# EAGLE design RPi-UNO-HAT_v11 (EAGLE 7.7.0)
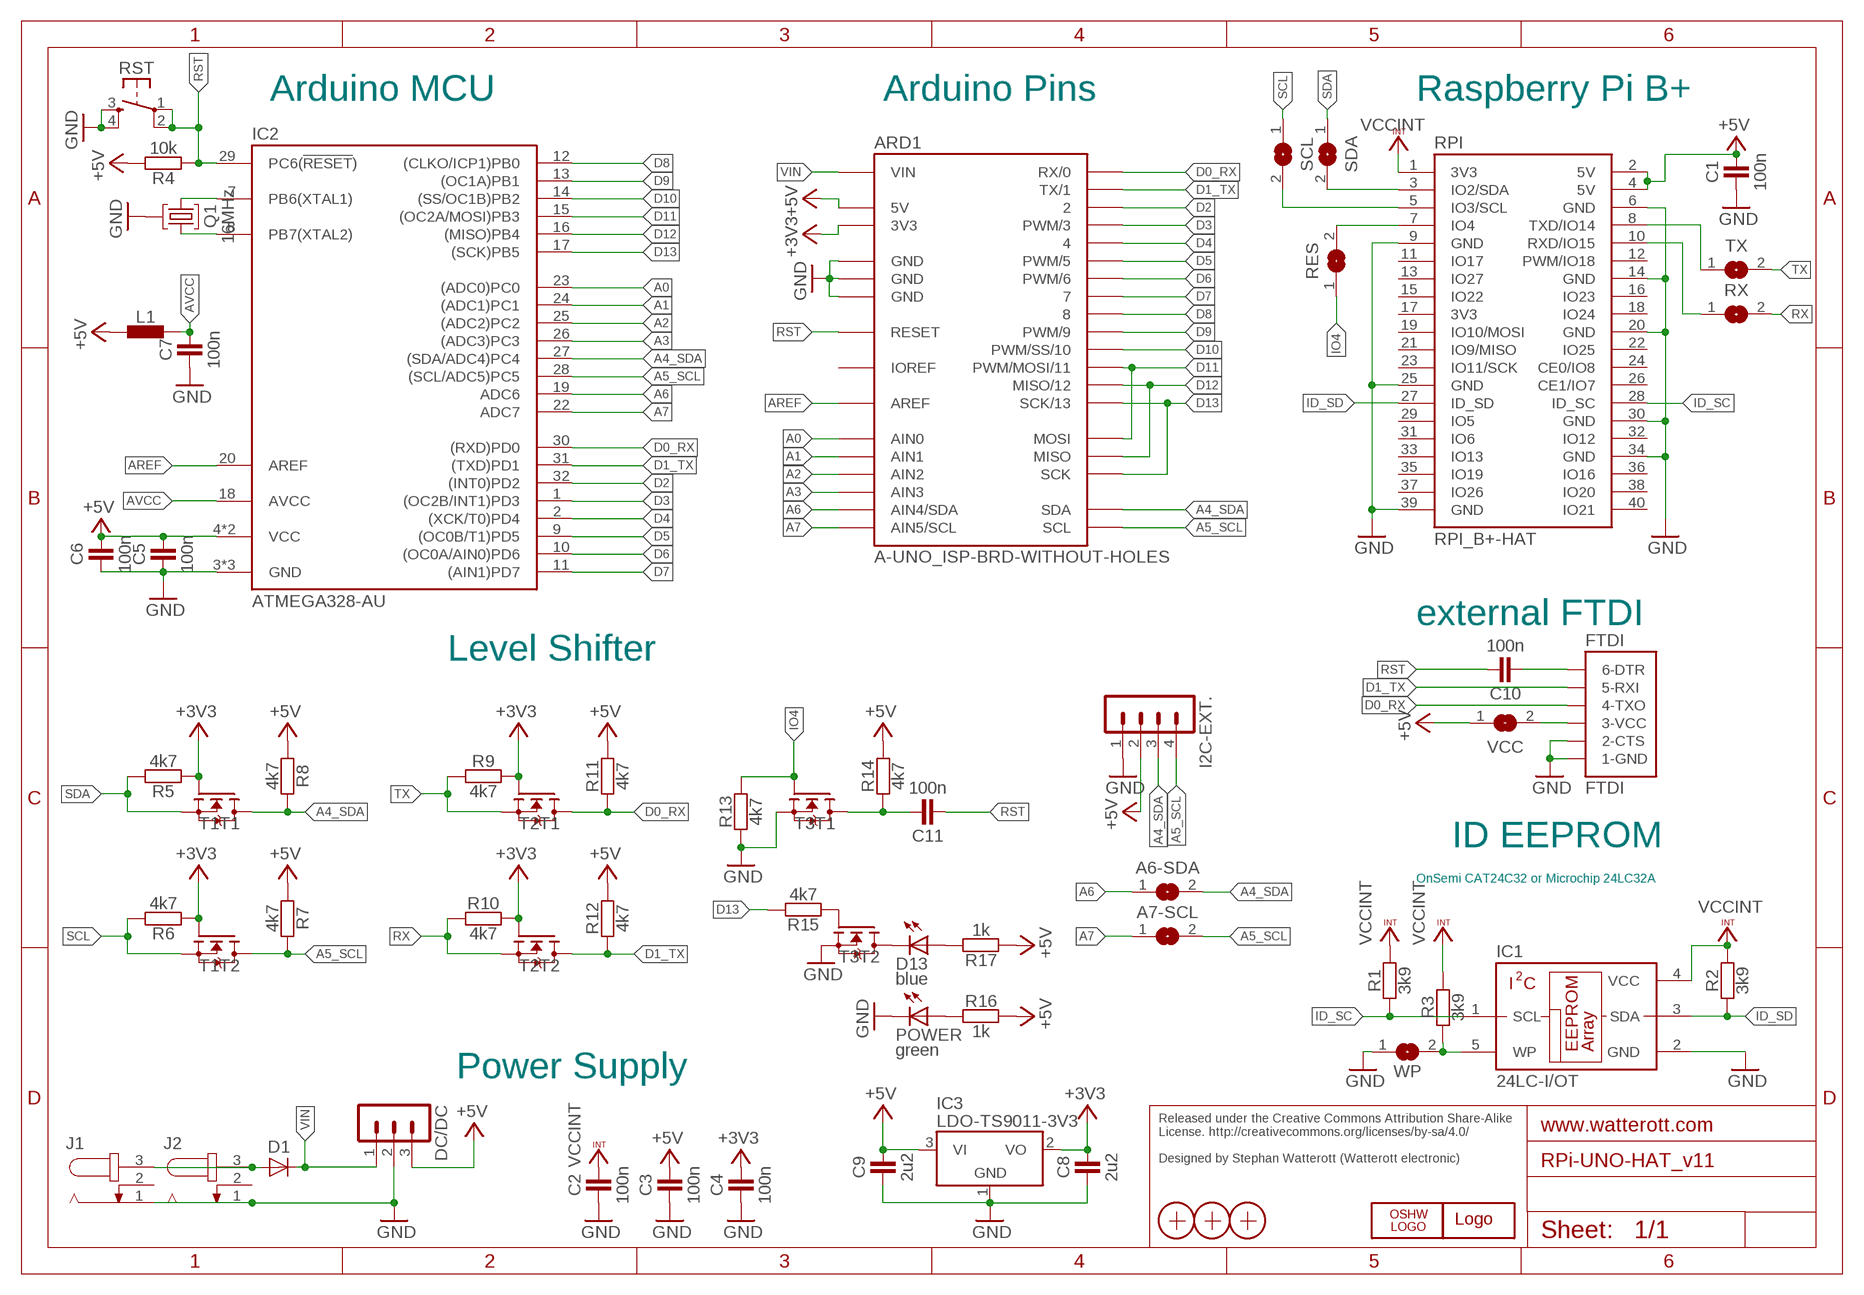
[diagram p0: schematic, sheet 1]

## Parts
A6-SDA  JUMPER2-0402-NC  [JUMPER2-0402_NC]
A7-SCL  JUMPER2-0402-NC  [JUMPER2-0402_NC]
ARD1  A-UNO_ISP-BRD-WITHOUT-HOLES  [A-UNO-ISP_CON-WITHOUT-HOLES]
C1  100n  CAPACITOR-0402  [C0402]
C2  100n  CAPACITOR-0402  [C0402]
C3  100n  CAPACITOR-0402  [C0402]
C4  100n  CAPACITOR-0402  [C0402]
C5  100n  CAPACITOR-0402  [C0402]
C6  100n  CAPACITOR-0402  [C0402]
C7  100n  CAPACITOR-0402  [C0402]
C8  2u2  CAPACITOR-0402  [C0402]
C9  2u2  CAPACITOR-0402  [C0402]
C10  100n  CAPACITOR-0402  [C0402]
C11  100n  CAPACITOR-0402  [C0402]
D1  DIODE-SOD80  [SOD80]
D13  blue  LED-0603  [C0603]
DC/DC  MA03-1  [MA03-1]
FTDI  FTDI  [FTDI]
I2C-EXT.  JST_PH_4B4B-PH-SM4-TB  [JST_B4B-PH-SM4-TB]
IC1  24LC-I/OT  [SOT23-5]
IC2  ATMEGA328-AU  [TQFP32]
IC3  LDO-TS9011-3V3  [SOT23]
J1  DC-JACK  [DC-JACK]
J2  DC-JACK  [DC-JACK]
L1  INDUCTOR-0603  [C0603]
LOGO1  LOGO-S_PLACE_S  [SPARK_TPLACE_S]
LOGO2  OSHW_LOGOX0070  [OSHW_6X70]
POWER  green  LED-0603  [C0603]
Q1  16MHz  CRYSTAL-RES-32  [CRYSTAL_32X13]
R1  3k9  RESISTOR-0402  [C0402]
R2  3k9  RESISTOR-0402  [C0402]
R3  3k9  RESISTOR-0402  [C0402]
R4  10k  RESISTOR-0402  [C0402]
R5  4k7  RESISTOR-0402  [C0402]
R6  4k7  RESISTOR-0402  [C0402]
R7  4k7  RESISTOR-0402  [C0402]
R8  4k7  RESISTOR-0402  [C0402]
R9  4k7  RESISTOR-0402  [C0402]
R10  4k7  RESISTOR-0402  [C0402]
R11  4k7  RESISTOR-0402  [C0402]
R12  4k7  RESISTOR-0402  [C0402]
R13  4k7  RESISTOR-0402  [C0402]
R14  4k7  RESISTOR-0402  [C0402]
R15  4k7  RESISTOR-0402  [C0402]
R16  1k  RESISTOR-0402  [C0402]
R17  1k  RESISTOR-0402  [C0402]
RES  JUMPER2-0402-NC  [JUMPER2-0402_NC]
RPI  RPI_B+-HAT  [RPI-B+HAT]
RST  SW-TACTILE-PTS840P  [SW_PTS840P]
RX  JUMPER2-0402-NC  [JUMPER2-0402_NC]
SCL  JUMPER2-0402-NC  [JUMPER2-0402_NC]
SDA  JUMPER2-0402-NC  [JUMPER2-0402_NC]
T1  BSS138PS  [SOT363]
T2  BSS138PS  [SOT363]
T3  BSS138PS  [SOT363]
TX  JUMPER2-0402-NC  [JUMPER2-0402_NC]
VCC  JUMPER2-0402-NC  [JUMPER2-0402_NC]
WP  JUMPER2-0603-NC  [JUMPER2-0603_NC]
X1  PASSER-07  [PASSER_07MM]
X2  PASSER-07  [PASSER_07MM]
X3  PASSER-07  [PASSER_07MM]

## Nets
+3V3: ARD1.3V3 C4.2 C8.2 IC3.2(VO) R5.1 R6.1 R9.2 R10.2 T1.2(T1:G) T1.5(T2:G) T2.2(T1:G) T2.5(T2:G)
+5V: ARD1.5V ARD1.VCC(5V) C1.2 C3.2 C5.2 C6.2 C9.2 DC/DC.3 I2C-EXT..2 IC2.4(VCC) IC2.6(VCC) IC3.3(VI) L1.1 R4.2 R7.1 R8.1 R11.2 R12.2 R14.2 R16.2 R17.1 RPI.2(5V) RPI.4(5V) VCC.1
A0: ARD1.A0(AIN0) IC2.23((ADC0)PC0)
A1: ARD1.A1(AIN1) IC2.24((ADC1)PC1)
A2: ARD1.A2(AIN2) IC2.25((ADC2)PC2)
A3: ARD1.A3(AIN3) IC2.26((ADC3)PC3)
A4_SDA: A6-SDA.2 ARD1.SDA I2C-EXT..3 IC2.27((SDA/ADC4)PC4) R8.2 T1.6(T1:D)
A5_SCL: A7-SCL.2 ARD1.SCL I2C-EXT..4 IC2.28((SCL/ADC5)PC5) R7.2 T1.3(T2:D)
A6: A6-SDA.1 ARD1.A4(AIN4/SDA) IC2.19(ADC6)
A7: A7-SCL.1 ARD1.A5(AIN5/SCL) IC2.22(ADC7)
AREF: ARD1.AREF IC2.20(AREF)
AVCC: C7.2 IC2.18(AVCC) L1.2
D0_RX: ARD1.0(RX/0) FTDI.4-TX(4-TXO) IC2.30((RXD)PD0) R11.1 T2.6(T1:D)
D0_RX1: C11.2 R14.1 T3.6(T1:D)
D1_TX: ARD1.1(TX/1) FTDI.5-RX(5-RXI) IC2.31((TXD)PD1) R12.1 T2.3(T2:D)
D2: ARD1.2 IC2.32((INT0)PD2)
D3: ARD1.3(PWM/3) IC2.1((OC2B/INT1)PD3)
D4: ARD1.4 IC2.2((XCK/T0)PD4)
D5: ARD1.5(PWM/5) IC2.9((OC0B/T1)PD5)
D6: ARD1.6(PWM/6) IC2.10((OC0A/AIN0)PD6)
D7: ARD1.7 IC2.11((AIN1)PD7)
D8: ARD1.8 IC2.12((CLKO/ICP1)PB0)
D9: ARD1.9(PWM/9) IC2.13((OC1A)PB1)
D10: ARD1.10(PWM/SS/10) IC2.14((SS/OC1B)PB2)
D11: ARD1.11(PWM/MOSI/11) ARD1.MOSI IC2.15((OC2A/MOSI)PB3)
D12: ARD1.12(MISO/12) ARD1.MISO IC2.16((MISO)PB4)
D13: ARD1.13(SCK/13) ARD1.SCK IC2.17((SCK)PB5) R15.2
GND: ARD1.GND@1(GND) ARD1.GND@2(GND) ARD1.GND@3(GND) ARD1.GND@4(GND) C1.1 C2.1 C3.1 C4.1 C5.1 C6.1 C7.1 C8.1 C9.1 DC/DC.2 FTDI.1-GND FTDI.2-CTS I2C-EXT..1 IC1.2(GND) IC2.3(GND) IC2.5(GND) IC2.21(GND) IC3.1(GND) J1.1 J2.1 POWER.C Q1.GND R13.1 RPI.6(GND) RPI.9(GND) RPI.14(GND) RPI.20(GND) RPI.25(GND) RPI.30(GND) RPI.34(GND) RPI.39(GND) RST.3(S1) RST.4(S2) T3.1(T1:S) T3.4(T2:S) WP.1
ID_SC: IC1.1(SCL) R1.1 RPI.28(ID_SC)
ID_SD: IC1.3(SDA) R2.1 RPI.27(ID_SD)
IO4: R13.2 RES.1 T3.2(T1:G)
N$1: IC2.8(PB7(XTAL2)) Q1.1
N$2: IC2.7(PB6(XTAL1)) Q1.2
N$3: D1.A J1.3 J2.3
N$4: C10.1 FTDI.6-DTR
N$6: RPI.8(TXD/IO14) TX.1
N$7: RPI.10(RXD/IO15) RX.1
N$8: RES.2 RPI.7(IO4)
N$9: FTDI.3-VCC VCC.2
N$10: RPI.5(IO3/SCL) SCL.2
N$11: RPI.3(IO2/SDA) SDA.2
N$12: R15.1 T3.5(T2:G)
N$13: POWER.A R16.1
N$14: D13.A R17.2
N$15: D13.C T3.3(T2:D)
RST: ARD1.RST2(RESET) ARD1.RST(RESET) C10.2 C11.1 IC2.29(PC6(!RESET!)) R4.1 RST.1 RST.2
RX: R10.1 RX.2 T2.4(T2:S)
SCL: R6.2 SCL.1 T1.4(T2:S)
SDA: R5.2 SDA.1 T1.1(T1:S)
TX: R9.1 T2.1(T1:S) TX.2
VCCINT: C2.2 IC1.4(VCC) R1.2 R2.2 R3.2 RPI.1(3V3)
VIN: ARD1.VIN D1.C DC/DC.1
WP: IC1.5(WP) R3.1 WP.2
Unconnected: J1.2 J2.2 RPI.11(IO17) RPI.12(PWM/IO18) RPI.13(IO27) RPI.15(IO22) RPI.16(IO23) RPI.17(3V3) RPI.18(IO24) RPI.19(IO10/MOSI) RPI.21(IO9/MISO) RPI.22(IO25) RPI.23(IO11/SCK) RPI.24(CE0/IO8) RPI.26(CE1/IO7) RPI.29(IO5) RPI.31(IO6) RPI.32(IO12) RPI.33(IO13) RPI.35(IO19) RPI.36(IO16) RPI.37(IO26) RPI.38(IO20) RPI.40(IO21)

## Notes on the sheet
- Arduino MCU | Arduino Pins | Raspberry Pi B+
- external FTDI
- Level Shifter
- ID EEPROM
- OnSemi CAT24C32 or Microchip 24LC32A
- Power Supply
- Released under the Creative Commons Attribution Share-Alike 
  License. http://creativecommons.org/licenses/by-sa/4.0/
  
  Designed by Stephan Watterott (Watterott electronic)

## Power pins joined to a net without a drawn wire
IOREF: ARD1.IOREF

## Library data of the parts
A6-SDA A7-SCL RES RX SCL SDA TX VCC WP = we-rcl:JUMPER2: 2 Pin Jumpers
ARD1 = we-board:A-UNO_ISP: Arduino Uno
C1-C11 = we-rcl:CAPACITOR: Capacitors ...4.7uF @ 6.3V -> 0402 ...10uF @ 16V -> 0603 ...22uF @ 25V -> 0805
D1 = we-rcl:DIODE: Diodes
D13 POWER = we-opto:LED: LEDs
DC/DC = we-con:MA03-1: Pin Header
FTDI = we-board:FTDI: FTDI 6pol connector
I2C-EXT. = we-con:JST_PH_4: JST Connector
IC1 = we-chip:24LC*: Microchip I2C EEPROM 2 Kbit - 24LC02B - 24LC02BT-I/OTDKR-ND 32 Kbit- 24LC32A - 24LC32AT-I/OTDKR-ND; DIGIKEY: 24LC32AT-I/OTDKR-ND
IC2 = we-chip:ATMEGA328: Atmel ATmega48/88/168/328 AVR Microcontroller
IC3 = we-power:LDO: LDOs TS1117 800mA, Vin max 12V - compatible NCP1117 1A, Vin max 20V TS9011 250mA, Vin max 12V - compatible AP2210 300mA, Vin max 15V TS5204 150mA, Vin max 16V
J1 J2 = we-con:DC-JACK: DC Jack (2.1mm)
L1 = we-rcl:INDUCTOR: Inductors
LOGO1 = we-symbol:LOGO: Watterott electronic Logo
LOGO2 = we-symbol:OSHW_LOGO: Open-Source-Hardware Logo
Q1 = we-rcl:CRYSTAL-RES: Crystal Resonators
R1-R17 = we-rcl:RESISTOR: Resistors all kinds in 0603 and 0402
RPI = we-board:RPI_B+: Raspberry Pi Model B+
RST = we-switch:SW-TACTILE: Tactile Switches; DIGIKEY: CKN10511DKR-ND
T1-T3 = we-transistor:BSS138PS: BSS138 Dual N-Channel MOSFET (UGS +/-20V, RDS 1Ohm, ID 320mA)
X1-X3 = we-symbol:PASSER: Fiducial Markers

## Board
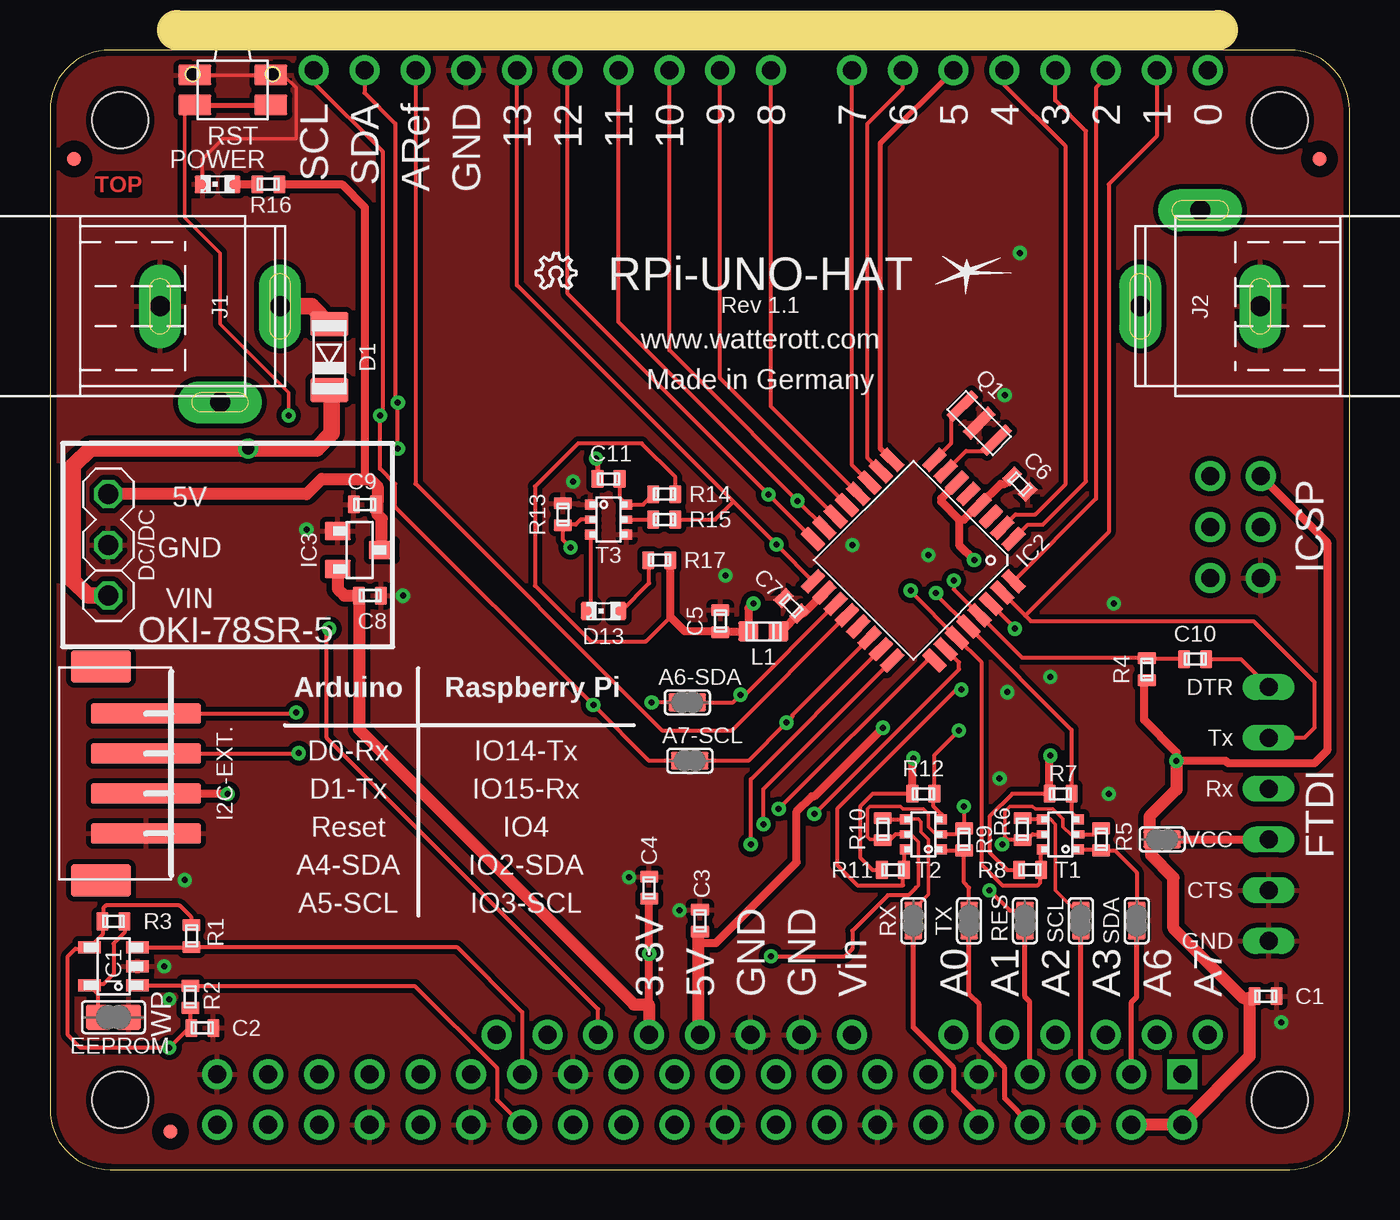
[diagram p1: board, top side]
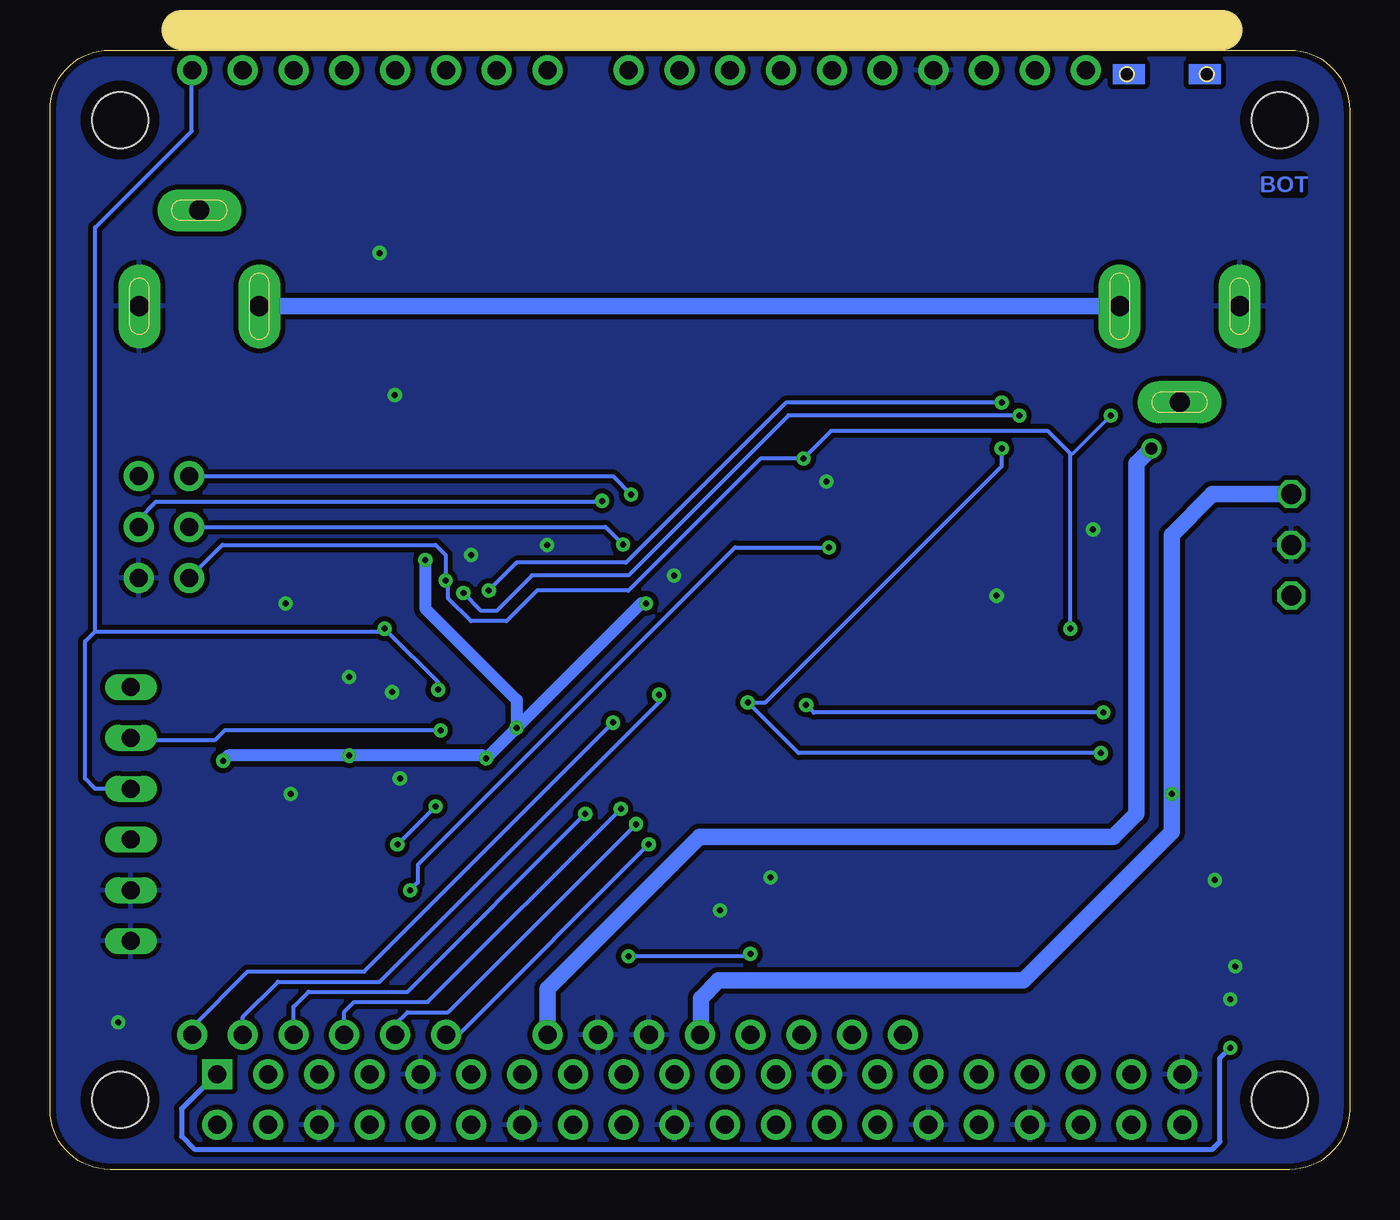
[diagram p2: board, bottom side, seen from below]

Size 65 x 56 mm. Coordinates in mm from the lower left corner, seen from the top.
Copper layers (1*16): Top 0.035mm / dielectric 1.5mm / Bottom 0.035mm
Design rules "default *": minimum track width 6mil, minimum drill 0.29mm, track to track 6mil, track to pad 6mil, pad to pad 6mil, via to via 6mil, smd to smd 6mil, copper to edge 0.3mm, drill to drill 8mil, minimum pad ring 7mil, minimum via ring 8mil, stop-mask expansion 0.3mm, vias tented up to drill 0.7mm, thermal gap 10mil
bRestrict: area 60,51 to 63,54; area 2,51 to 5,54; area 60,2 to 63,5; area 2,2 to 5,5
Milling: 1 lines

### Footprints (pad centres in the part's own frame; a part is rotated, then mirrored left to right if it is on the bottom)
JUMPER2-0402_NC = smd 0.9 x 0.8: 1 0,0.55; 2 0,-0.55
A-UNO-ISP_CON-WITHOUT-HOLES = drill 0.9 pad 1.5: 0 63.5,50.8; 1 60.96,50.8; 2 58.42,50.8; 3 55.88,50.8; 3V3 35.56,2.54; 4 53.34,50.8; 5 50.8,50.8; 5V 38.1,2.54; 6 48.26,50.8; 7 45.72,50.8; 8 41.656,50.8; 9 39.116,50.8; 10 36.576,50.8; 11 34.036,50.8; 12 31.496,50.8; 13 28.956,50.8; A0 50.8,2.54; A1 53.34,2.54; A2 55.88,2.54; A3 58.42,2.54; A4 60.96,2.54; A5 63.5,2.54; AREF 23.876,50.8; GND@1 40.64,2.54; GND@2 43.18,2.54; GND@3 26.416,50.8; GND@4 66.167,25.4; IOREF 30.48,2.54; MISO 63.627,30.48; MOSI 66.167,27.94; NC 27.94,2.54; RST 33.02,2.54; RST2 63.627,25.4; SCK 63.627,27.94; SCL 18.796,50.8; SDA 21.336,50.8; VCC 66.167,30.48; VIN 45.72,2.54
C0402 = smd 0.9 x 0.6: 1 0,0.55; 2 0,-0.55
SOD80 = smd 1.9 x 1.2: A 0,-1.65; C 0,1.65
C0603 = smd 0.9 x 0.8: A 0,-0.75; C 0,0.75
MA03-1 = drill 1 octagon: 1 0,2.54; 2 0,0; 3 0,-2.54
FTDI = drill 0.9 pad 1.3 long: 1-GND -6.35,0; 2-CTS -3.81,0; 3-VCC -1.27,0; 4-TX 1.27,0; 5-RX 3.81,0; 6-DTR 6.35,0
JST_B4B-PH-SM4-TB = smd 5.5 x 1: 1 0,3; 2 0,1; 3 0,-1; 4 0,-3 | smd 3 x 1.6: SHLD1 2.25,5.35; SHLD2 2.25,-5.35
SOT23-5 = smd 1.2 x 0.6: 1 -1.2,0.95; 2 -1.2,0; 3 -1.2,-0.95; 4 1.2,-0.95; 5 1.2,0.95
TQFP32 = smd 1.27 x 0.559: 1 -4.293,2.8; 2 -4.293,2; 3 -4.293,1.2; 4 -4.293,0.4; 5 -4.293,-0.4; 6 -4.293,-1.2; 7 -4.293,-2; 8 -4.293,-2.8; 17 4.293,-2.8; 18 4.293,-2; 19 4.293,-1.2; 20 4.293,-0.4; 21 4.293,0.4; 22 4.293,1.2; 23 4.293,2; 24 4.293,2.8 | smd 0.559 x 1.27: 9 -2.8,-4.293; 10 -2,-4.293; 11 -1.2,-4.293; 12 -0.4,-4.293; 13 0.4,-4.293; 14 1.2,-4.293; 15 2,-4.293; 16 2.8,-4.293; 25 2.8,4.293; 26 2,4.293; 27 1.2,4.293; 28 0.4,4.293; 29 -0.4,4.293; 30 -1.2,4.293; 31 -2,4.293; 32 -2.8,4.293
SOT23 = smd 1.3 x 0.9: 1 -1.1,0.95; 2 -1.1,-0.95; 3 1.1,0
DC-JACK = drill 1 pad 2.1 long: 1 3,0; 2 0,4.8; 3 -3,0
C0603' = smd 1 x 1: 1 0,0.75; 2 0,-0.75
CRYSTAL_32X13 = smd 1.8 x 0.5: 1 0,1.2; 2 0,-1.2 | smd 1.8 x 0.6: GND 0,0
RPI-B+HAT = drill 0.9 pad 1.5 square: 1 56.63,4.77 | drill 0.9 pad 1.5: 2 56.63,2.23; 3 54.09,4.77; 4 54.09,2.23; 5 51.55,4.77; 6 51.55,2.23; 7 49.01,4.77; 8 49.01,2.23; 9 46.47,4.77; 10 46.47,2.23; 11 43.93,4.77; 12 43.93,2.23; 13 41.39,4.77; 14 41.39,2.23; 15 38.85,4.77; 16 38.85,2.23; 17 36.31,4.77; 18 36.31,2.23; 19 33.77,4.77; 20 33.77,2.23; 21 31.23,4.77; 22 31.23,2.23; 23 28.69,4.77; 24 28.69,2.23; 25 26.15,4.77; 26 26.15,2.23; 27 23.61,4.77; 28 23.61,2.23; 29 21.07,4.77; 30 21.07,2.23; 31 18.53,4.77; 32 18.53,2.23; 33 15.99,4.77; 34 15.99,2.23; 35 13.45,4.77; 36 13.45,2.23; 37 10.91,4.77; 38 10.91,2.23; 39 8.37,4.77; 40 8.37,2.23 | hole 2.8: 3.5,3.5; 3.5,52.5; 61.5,52.5; 61.5,3.5
SW_PTS840P = smd 1.65 x 1: 1 -1.9,0.75; 2 1.9,0.75; 3 -1.9,-0.75; 4 1.9,-0.75 | hole 0.7: -2,-0.8; 2,-0.8
SOT363 = smd 0.6 x 0.5: 1 -0.9,0.75; 3 -0.9,-0.75; 4 0.9,-0.75; 6 0.9,0.75 | smd 0.6 x 0.4: 2 -0.9,0; 5 0.9,0
JUMPER2-0603_NC = smd 1.25 x 1.25: 1 0,0.76; 2 0,-0.76
PASSER_07MM = smd 0.7 x 0.7: X 0,0

### Placement (x,y rotation side)
A6-SDA  31.88,23.37 270 top
A7-SCL  32,20.45 270 top
ARD1  -5.6,4.2 0 top
C1  60.8,8.67 270 top
C2  7.62,7.08 270 top
C3  32.51,12.45 0 top
C4  29.97,14.1 0 top
C5  33.53,27.43 0 top
C6  48.51,34.29 225 top
C7  37.08,28.19 45 top
C8  16,28.7 270 top
C9  15.75,33.27 90 top
C10  57.28,25.53 270 top
C11  27.94,34.54 90 top
D1  13.97,40.64 180 top
D13  27.69,27.94 90 top
DC/DC  2.92,31.24 180 top
FTDI  60.96,17.78 90 top
I2C-EXT.  4.8,19.81 180 top
IC1  3.17,10.16 180 top
IC2  43.18,30.48 225 top
IC3  15.49,30.99 0 top
J1  8.5,43.18 180 top
J2  57.53,43.18 0 top
L1  [C0603']  35.69,26.92 90 top
LOGO1  45.88,44.89 0 top
LOGO2  24.32,44.07 0 top
POWER  8.38,49.28 90 top
Q1  46.48,37.34 45 top
R1  7.02,8.64 0 top
R2  7.08,11.68 180 top
R3  3.17,12.41 270 top
R4  54.86,25.02 0 top
R5  52.58,16.51 0 top
R6  48.64,17.02 180 top
R7  50.55,18.8 90 top
R8  49.02,14.99 90 top
R9  45.72,16.51 180 top
R10  41.66,17.02 0 top
R11  42.16,14.99 270 top
R12  43.69,18.8 270 top
R13  25.65,32.77 0 top
R14  30.73,33.78 90 top
R15  30.73,32.51 90 top
R16  10.92,49.28 90 top
R17  30.48,30.48 270 top
RES  48.77,12.45 0 top
RPI  0,0 0 top
RST  9.14,54 180 top
RX  43.18,12.45 180 top
SCL  51.56,12.45 0 top
SDA  54.36,12.45 0 top
T1  50.55,16.76 180 top
T2  43.69,16.76 180 top
T3  27.94,32.51 0 top
TX  45.97,12.45 180 top
VCC  55.63,16.51 90 top
WP  3.17,7.62 270 top
X1  6.03,1.91 0 top
X2  1.21,50.55 0 top
X3  63.5,50.55 0 top

### Tracks (layer width: path | path; a pad name or v marks a point on that pad's centre or on a via)
+3V3  (via drill 0.3)
  Top 0.18: T1.2 51.05,16.76 50.67,17.14 50.67,17.53 50.16,18.03 49.28,18.03 49.15,18.16 48.01,18.16 47.75,17.91 47.75,16.64 | T2.2 44.32,16.76 43.94,17.14 43.94,17.78 43.69,18.03 42.67,18.03 42.55,18.16 41.02,18.16 40.89,18.03 40.89,16.64 41.02,16.51 41.61,16.51 R10.2 | 42.93,16.76 43.05,16.76 43.43,16.38 43.43,14.22 43.31,14.1
  Top 0.2: T1.2 52.28,16.76 R5.1 | T1.5 49.15,16.76 48.85,16.47 R6.1 48.51,16.47 48.47,16.51 47.88,16.51 47.75,16.64 47.75,16.38 v47.62,16.26 | T2.2 45.42,16.76 R9.2 v45.72,18.16 | v36.07,10.67 39.75,10.67 40.13,11.05 40.13,11.94 41.91,13.72 42.93,13.72 43.31,14.1 | 42.93,16.76 T2.5 42.29,16.76 41.99,16.47 R10.2 | 29.97,6.86 29.96,6.87 29.96,8.26
  Top 0.406: 29.97,6.86 v29.97,10.79 C4.2
  Top 0.61: IC3.2 14.39,29.04 14.73,28.7 C8.2 15.45,22.01 29.21,8.26 29.96,8.26 ARD1.3V3
  Bottom 0.2: v47.62,16.26 v45.72,18.16 | v29.97,10.79 30.1,10.79 30.23,10.67 v36.07,10.67
+5V  (via drill 0.3)
  Top 0.2: R7.1 48.13,18.8 46.99,17.65 46.99,15.88 47.88,14.99 R8.1 | R12.2 41.15,18.8 40.51,18.16 40.51,15.62 41.15,14.99 R11.2 | R14.2 31.28,34.63 29.59,36.32 26.42,36.32 24.26,34.16 24.26,29.21 27.05,26.42 29.8,26.42 31.03,27.64 | 32.58,11.32 32.51,11.39 C3.2
  Top 0.254: 8.87,18.81 v8.89,18.8
  Top 0.406: RPI.2 56.63,2.27 | 60.01,8.59 C1.2 | C6.2 48.12,34.66 47.75,34.29 47.56,34.29 IC2.4 46.44,33.23 45.72,32.51 45.47,32.51 | IC2.6 44.58,33.57 44.58,33.4 45.47,32.51 | ARD1.5V 32.45,6.79 | R16.2 14.61,49.28 15.75,48.13 15.75,34.8 16,34.54 | R4.2 54.74,24.34 54.74,22.48 56.35,20.87 v56.35,20.45 58.8,20.45 58.93,20.32 63.25,20.32 63.88,20.95 63.88,31.37 ARD1.VCC | R7.1 50,20.66 v50.04,20.7 | R12.2 43.14,20.53 v43.18,20.57 | v41.66,22.1 38.23,18.67 38.1,18.67 37.34,17.91 37.34,15.37 33.3,11.32 32.58,11.32 | 45.47,32.51 45.47,31.24 v46.23,30.48 | v35.18,28.32 34.94,28.08 L1.1 33.57,26.92 | C5.2 33.57,26.92 | 33.57,26.92 31.75,26.92 31.03,27.64 R17.1 | 54.99,16.59 VCC.1 | C3.2 32.45,11.83 | I2C-EXT..2 8.87,18.81
  Top 0.61: RPI.2 RPI.4 | 56.63,2.27 60.01,5.65 60.01,8.59 59.99,8.57 59.69,8.57 56.2,12.06 56.2,14.61 55.08,15.73 VCC.1 | IC3.3 16.59,32.55 16.38,32.77 16.38,33.19 C9.2 16.38,33.36 16.38,34.16 16,34.54 13.59,34.54 12.83,33.78 DC/DC.3 | 32.45,6.79 32.45,11.83 | v56.35,20.45 56.35,19.01 54.99,17.65 54.99,16.59
  Bottom 0.61: v56.35,20.45 56.09,20.7 v50.04,20.7 43.31,20.7 v43.18,20.57 v41.66,22.1 | v46.23,30.48 46.23,28.07 41.66,23.5 v41.66,22.1 | v41.66,22.1 35.43,28.32 v35.18,28.32
  Bottom 0.813: DC/DC.3 6.86,33.78 8.89,31.75 v8.89,18.8 8.89,16.89 16.32,9.46 31.56,9.46 32.45,8.57 32.45,6.79 ARD1.5V
A0  (via drill 0.3)
  Top 0.2: v35.05,16.26 35.05,19.52 IC2.23
  Bottom 0.2: ARD1.A0 44.57,6.74 v35.05,16.26
A1  (via drill 0.3)
  Top 0.2: v35.69,17.27 35.69,19.03 IC2.24
  Bottom 0.2: ARD1.A1 47.74,7.25 47.12,7.87 45.09,7.87 v35.69,17.27
A2  (via drill 0.3)
  Top 0.2: v36.45,18.03 43.88,25.46 IC2.25
  Bottom 0.2: ARD1.A2 50.28,7.89 49.78,8.38 46.1,8.38 v36.45,18.03
A3  (via drill 0.3)
  Top 0.2: v38.23,17.78 45.47,25.02 45.47,25.37 IC2.26
  Bottom 0.2: ARD1.A3 52.82,8.14 52.07,8.89 47.12,8.89 v38.23,17.78
A4_SDA  (via drill 0.3)
  Top 0.2: T1.6 49.57,15.94 R8.2 49.53,14.94 49.53,14.35 49.4,14.22 47.62,14.22 46.61,15.24 46.61,25.35 IC2.27 43.05,28.91 v43.05,28.96 | ARD1.SDA 15.74,53.86 17.27,52.32 17.27,38.48 v17.4,38.35 v17.4,36.07 | A6-SDA.2 v30.1,23.37 | I2C-EXT..3 12.43,20.81 v12.45,20.83
  Bottom 0.2: v43.05,28.96 41.66,30.35 36.2,30.35 28.19,38.35 v17.4,38.35 | v17.4,36.07 17.4,35.18 29.21,23.37 v30.1,23.37 27.56,20.83 v12.45,20.83
A5_SCL  (via drill 0.3)
  Top 0.2: T1.3 51.1,17.86 R7.2 51.1,22 IC2.28 44.32,28.77 v44.32,28.83 | ARD1.SCL 13.2,54.37 16.64,50.93 16.64,37.85 v16.51,37.72 16.51,35.05 17.27,34.29 17.27,33.15 v27.18,23.24 29.97,20.45 A7-SCL.2 | I2C-EXT..4 12.27,22.81 v12.32,22.86
  Bottom 0.2: v44.32,28.83 43.43,27.94 42.67,27.94 40.89,29.72 36.07,29.72 28.07,37.72 v16.51,37.72 | v12.32,22.86 26.8,22.86 v27.18,23.24
A6  (via drill 0.3)
  Top 0.2: IC2.19 34.75,23.75 v34.54,23.75 34.16,23.37 A6-SDA.1
  Bottom 0.2: ARD1.A4 55.36,7.63 53.59,9.4 48.51,9.4 34.42,23.5 34.42,23.62 v34.54,23.75
A7  (via drill 0.3)
  Top 0.2: IC2.22 37.13,22.73 37.13,22.65 v36.83,22.35 34.92,20.45 A7-SCL.1
  Bottom 0.2: ARD1.A5 57.9,7.12 55.12,9.91 49.28,9.91 v36.83,22.35
AREF
  Top 0.2: ARD1.AREF 18.28,34.3 30.61,21.97 34.1,21.97 IC2.20
AVCC
  Top 0.406: IC2.18 37.69,27.82 37.49,27.82 C7.2 36.59,26.92 L1.2
D0_RX  (via drill 0.3)
  Top 0.2: T2.6 42.71,15.94 R11.1 42.67,14.94 42.67,14.22 40.39,14.22 39.37,15.24 39.37,18.03 45.34,24 v45.59,24 | v48.26,27.05 48.26,27.1 IC2.30
  Bottom 0.2: 62.74,26.92 48.39,26.92 | 48.39,26.92 v48.26,27.05 | 48.39,26.92 48.13,26.92 45.59,24.38 v45.59,24 | 62.74,26.92 62.74,47.12 57.91,51.94 57.91,54.99 ARD1.0 | FTDI.4-TX 62.74,19.05 63.25,19.56 63.25,26.42 62.74,26.92
D0_RX1
  Top 0.2: R14.1 29.66,33.26 T3.6 28.49,33.61 C11.2
D1_TX  (via drill 0.3)
  Top 0.2: IC2.31 48.78,27.7 | 48.78,27.7 49.06,27.43 60.2,27.43 63.25,24.38 63.25,22.1 62.74,21.59 FTDI.5-RX | T2.3 44.59,17.77 44.2,18.16 44.2,18.75 R12.1 44.24,20.74 v45.47,21.97 | ARD1.1 55.36,51.68 52.96,49.28 52.96,31.88 48.78,27.7
  Bottom 0.2: v45.47,21.97 56.26,21.97 56.77,21.46 60.83,21.46 FTDI.5-RX
D2
  Top 0.2: ARD1.2 52.82,54.6 52.32,54.1 52.32,33.55 IC2.32
D3
  Top 0.2: IC2.1 48.92,32.26 49.66,32.26 51.82,34.42 51.82,51.94 50.28,53.48 ARD1.3
D4
  Top 0.2: IC2.2 48.29,32.77 49.28,32.77 50.8,34.29 50.8,51.18 47.74,54.24 ARD1.4
D5
  Top 0.254: IC2.9 42.1,35.49 41.53,36.07 41.53,51.33 ARD1.5
D6
  Top 0.2: IC2.10 40.89,35.59 40.89,52.32 42.66,54.09 ARD1.6
D7
  Top 0.2: IC2.11 40.12,35.24 ARD1.7
D8
  Top 0.2: IC2.12 36.06,38.17 ARD1.8
D9
  Top 0.2: IC2.13 33.52,39.58 ARD1.9
D10
  Top 0.2: IC2.14 30.98,40.99 ARD1.10
D11  (via drill 0.3)
  Top 0.2: IC2.15 v37.38,33.45 36.69,34.15 28.44,42.4 ARD1.11
  Bottom 0.2: ARD1.MOSI 60.57,32.52 59.69,33.4 37.43,33.4 v37.38,33.45
D12  (via drill 0.3)
  Top 0.2: IC2.16 36.18,33.52 v35.93,33.77 25.9,43.8 ARD1.12
  Bottom 0.2: ARD1.MISO 36.84,34.68 v35.93,33.77
D13  (via drill 0.3)
  Top 0.2: IC2.17 36.46,31.13 v36.34,31.25 34.18,33.41 | 34.18,33.41 23.36,44.23 ARD1.13 | R15.2 33.27,32.51 34.18,33.41
  Bottom 0.2: ARD1.SCK 37.22,32.14 v36.34,31.25
GND  (via drill 0.3)
  Top 0.18: RST.4 11.67,54.75 12.32,54.1 12.32,51.56 8.64,51.56 7.62,50.55 POWER.C
  other vias: 6.73,14.48 5.97,8.51 5.71,10.16 33.78,29.72 40.13,31.24 47.75,38.73 43.94,30.73 53.21,28.32 28.96,14.61 31.5,12.95 61.59,7.37 50.04,24.64 47.88,23.88 47.5,19.56 26.16,34.42 12.83,32 17.65,28.7 52.96,18.8 48.51,45.85
  pour Top (isolate 0.254): 0,0 65,0 65,56 0,56
  pour Bottom (isolate 0.254): 0,0 65,0 65,56 0,56
ID_SC
  Top 0.2: IC1.1 6.99,9.21 R1.1 18.25,9.19 22.35,5.08 22.35,3.49 RPI.28
ID_SD
  Top 0.2: IC1.3 7.06,11.11 R2.1 20.36,11.13 23.62,7.87 23.62,4.78 RPI.27
IO4  (via drill 0.3)
  Top 0.2: T3.2 26.54,32.51 26.29,32.26 25.7,32.26 R13.2 25.65,31.5 v26.04,31.11 | v46.99,13.97 48.01,12.95 48.73,12.95 RES.1
  Bottom 0.2: v26.04,31.11 30.73,31.11 46.61,15.24 46.61,14.35 v46.99,13.97
N$1
  Top 0.2: IC2.8 45.09,36.34 45.09,37.59 45.63,38.14 Q1.1
N$2
  Top 0.2: IC2.7 45.81,35.94 46.74,35.94 47.28,36.49 Q1.2
N$3
  Top 0.813: J1.3 13.08,43.18 D1.A
  Bottom 0.813: J2.3 J1.3
N$4
  Top 0.2: C10.1 59.56,25.53 FTDI.6-DTR
N$5
  Top 0.2: 54.36,11.94 54.36,12.95
N$6
  Top 0.254: RPI.8 49.01,2.3 47.75,3.56 47.75,5.08 46.48,6.35 46.48,8.26 45.97,8.76 TX.1
N$7
  Top 0.254: RPI.10 46.47,2.68 45.21,3.94 45.21,5.08 43.18,7.11 RX.1
N$8
  Top 0.254: RPI.7 49.01,8.39 48.77,8.64 RES.2
N$9
  Top 0.406: VCC.2 FTDI.3-VCC
N$10
  Top 0.254: RPI.5 51.55,10.61 51.56,10.63 SCL.2
N$11
  Top 0.254: RPI.3 54.09,8.37 54.36,8.64 SDA.2
N$12
  Top 0.2: T3.5 R15.1
N$13
  Top 0.406: POWER.A R16.1
N$14
  Top 0.2: D13.A 28.57,27.94 29.97,29.34 29.97,30.44 R17.2
N$15
  Top 0.2: T3.3 27.04,28.04 D13.C
N$16
  Top 0.2: 48.77,11.94 48.77,12.95
N$17
  Top 0.2: 43.18,11.94 43.18,12.95
RST  (via drill 0.3)
  Top 0.18: v11.94,37.72 11.94,38.86 8.51,42.29 8.51,45.85 6.73,47.62 6.73,52.83
  Top 0.2: v45.21,29.46 45.21,29.01 IC2.29 48.61,25.61 54.82,25.61 R4.1 54.91,25.53 C10.2 | ARD1.RST 27.42,8.01 13.84,21.59 13.84,26.92 v13.97,27.05 | 10.78,53.23 6.74,53.23 6.73,52.83
  Top 0.254: RST.2 RST.1 10.78,53.23 | v27.3,35.56 27.39,35.48 C11.1
  Bottom 0.18: 13.97,35.81 13.84,35.81 v11.94,37.72
  Bottom 0.2: v13.97,27.05 13.97,35.81 15.11,36.96 25.91,36.96 v27.3,35.56 29.46,35.56 36.07,28.96 40.64,28.96 42.16,27.43 43.94,27.43 45.09,28.57 45.09,29.34 v45.21,29.46 45.21,30.73 45.72,31.24 56.38,31.24 ARD1.RST2
RX
  Top 0.18: 42.8,17.53 43.43,17.53 43.56,17.4 43.56,16.89 43.94,16.51 43.94,13.76 RX.2
  Top 0.2: R10.1 41.71,17.51 T2.4 42.8,17.53
SCL
  Top 0.18: 51.56,12.7 50.55,13.72 50.29,13.97 50.29,17.27 50.04,17.53 49.66,17.53
  Top 0.2: SCL.1 51.56,12.7 51.56,11.94 | 49.66,17.53 T1.4 48.57,17.51 48.62,17.57 R6.2
SDA
  Top 0.2: SDA.1 54.36,14.86 53.26,15.96 R5.2 52.52,16.01 T1.1
TX
  Top 0.2: T2.1 44.64,15.96 R9.1 45.72,14.35 45.97,14.1 45.97,13.08 TX.2 45.97,11.94
VCCINT  (via drill 0.3)
  Top 0.2: R1.2 7.02,7.14 v5.97,6.1 1.52,6.1 0.89,6.73 0.89,10.67 1.27,11.05 1.91,11.05 IC1.4 2.62,11.76 R3.2 2.67,12.46 2.67,13.08 2.79,13.21 6.48,13.21 7.08,12.61 R2.2
  Top 0.254: 7.02,7.14 7.02,7.13 C2.2
  Bottom 0.254: RPI.1 56.7,4.77 58.42,3.05 58.42,1.65 57.78,1.02 6.86,1.02 6.48,1.4 6.48,5.59 v5.97,6.1
VIN  (via drill 0.6)
  Top 0.2: v9.91,36.07 9.84,36.01 | 9.84,36.01 9.97,35.88 | 9.84,36.01 9.78,36.07 10.41,36.07
  Top 0.813: D1.C 14.1,38.86 14.1,36.83 13.34,36.07 10.41,36.07 v9.91,36.07 9.78,36.07 2.03,36.07 1.14,35.18 1.14,29.46 1.91,28.7 DC/DC.1
  Bottom 0.813: ARD1.VIN 40.12,9.03 32.51,16.64 11.81,16.64 10.67,17.78 10.67,35.31 v9.91,36.07
WP
  Top 0.2: WP.2 2.42,8.77 IC1.5 2.04,9.27 2.67,9.27 3.17,9.78 3.17,11.3 3.73,11.85 R3.1

### Text on the board
Top: TOP
Bottom: BOT
tPlace: SCL | SDA | ARef | GND | 13 | 12 | 11 | 10 | 9 | 8 | 7 | 6 | 5 | 4 | 3 | 2 | 1 | 0 | RPi-UNO-HAT | Rev 1.1 | www.watterott.com | Made in Germany | 5V | GND | ICSP | VIN | OKI-78SR-5 | Arduino | Raspberry Pi | DTR | Tx | D0-Rx | IO14-Tx | D1-Tx | IO15-Rx | Rx | Reset | IO4 | A4-SDA | IO2-SDA | CTS | A5-SCL | IO3-SCL | GND | 3.3V | 5V | GND | GND | Vin | A0 | A1 | A2 | A3 | A6 | A7 | EEPROM
Reference: Silkscreen: 21 tPlace